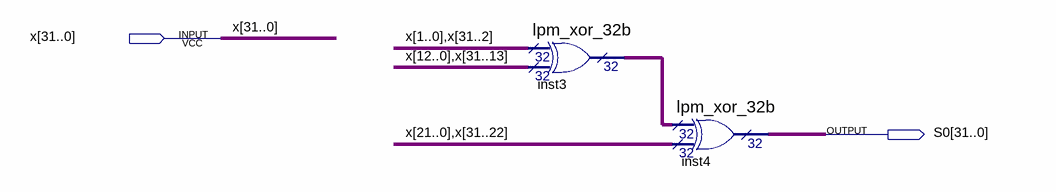
[diagram p0: schematic sheet]
// Quartus schematic S0.bdf as structural Verilog: 2 symbols, 2 pins
module S0 (
  input  [31:0] x,
  output [31:0] S0
);

  wire [31:0] inst3_result;

  lpm_xor_32b inst3 (.data0x({x[1:0], x[31:2]}), .data1x({x[12:0], x[31:13]}), .result(inst3_result));
  lpm_xor_32b inst4 (.data0x(inst3_result), .data1x({x[21:0], x[31:22]}), .result(S0));
endmodule
